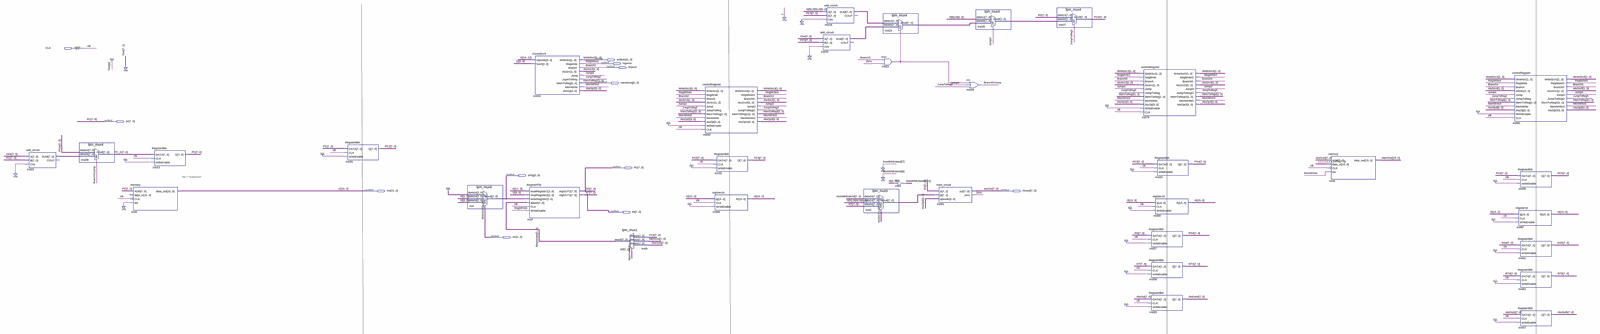
[diagram p0: schematic sheet, whole]
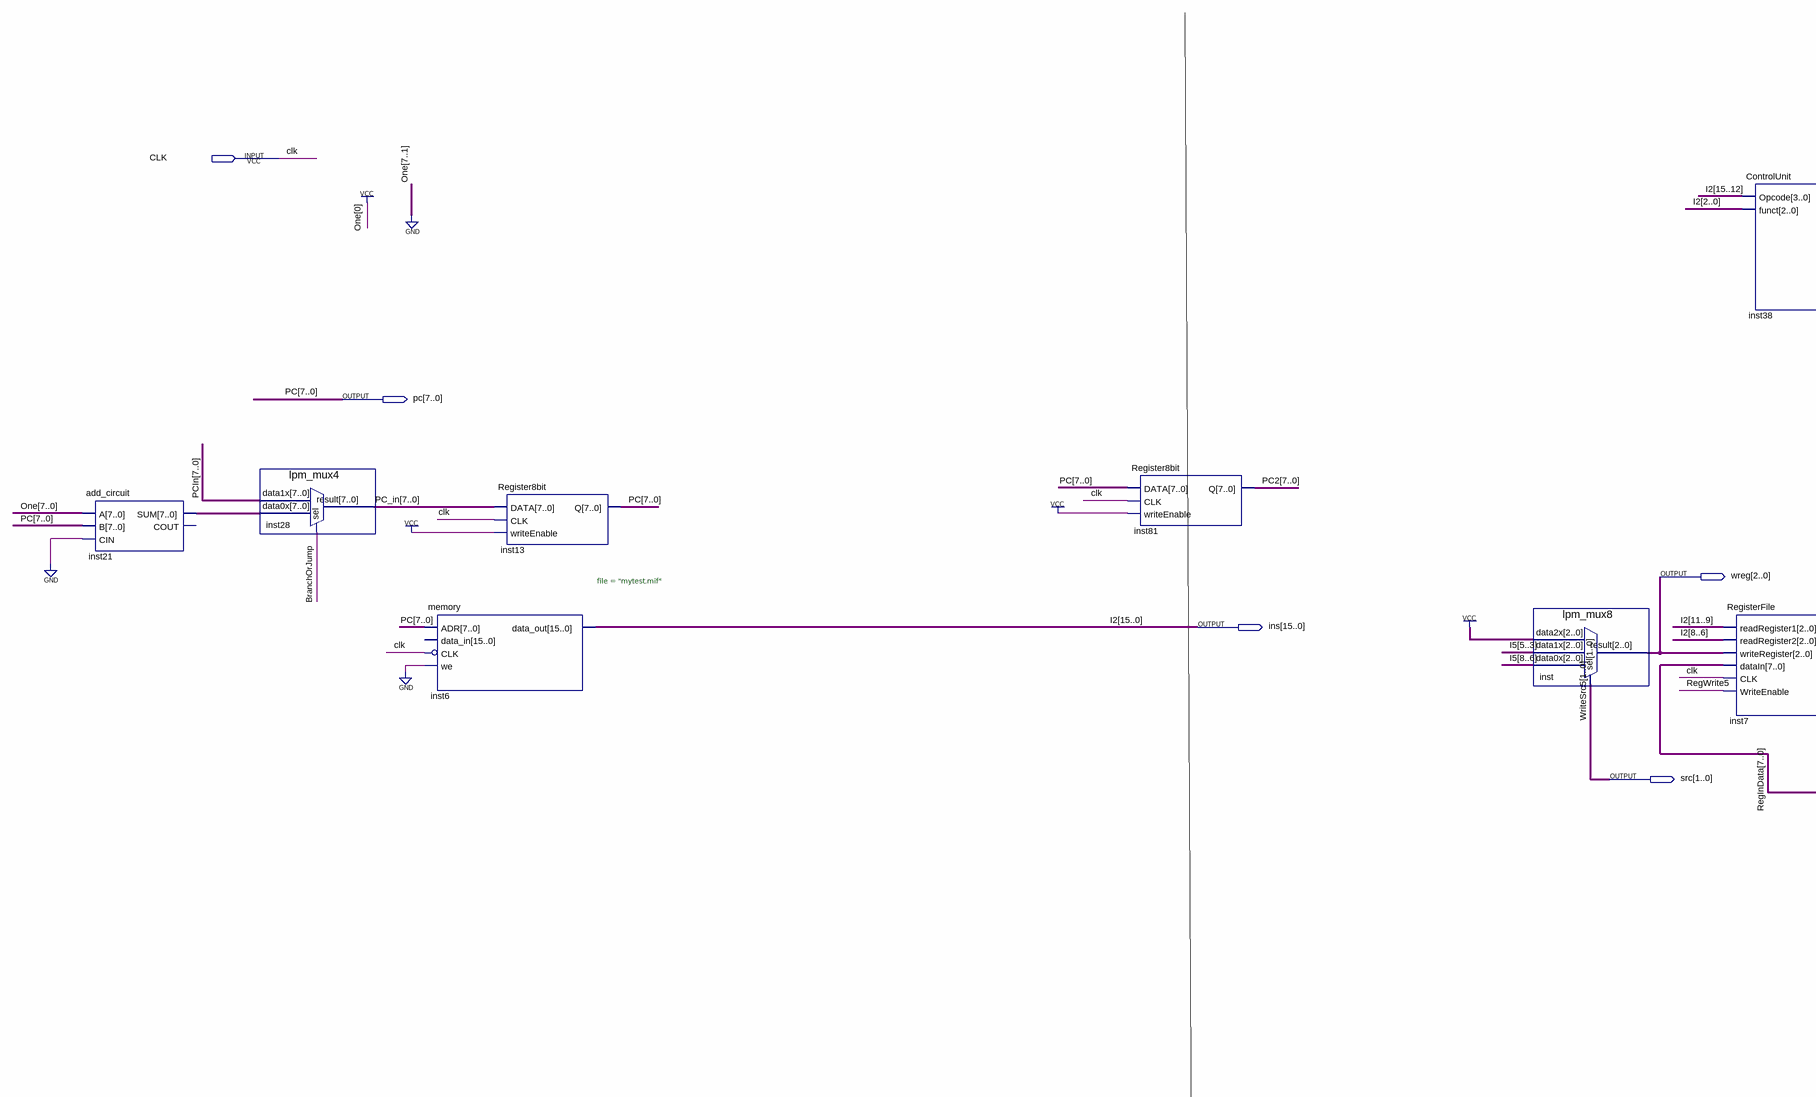
[diagram p1: schematic sheet, left part]
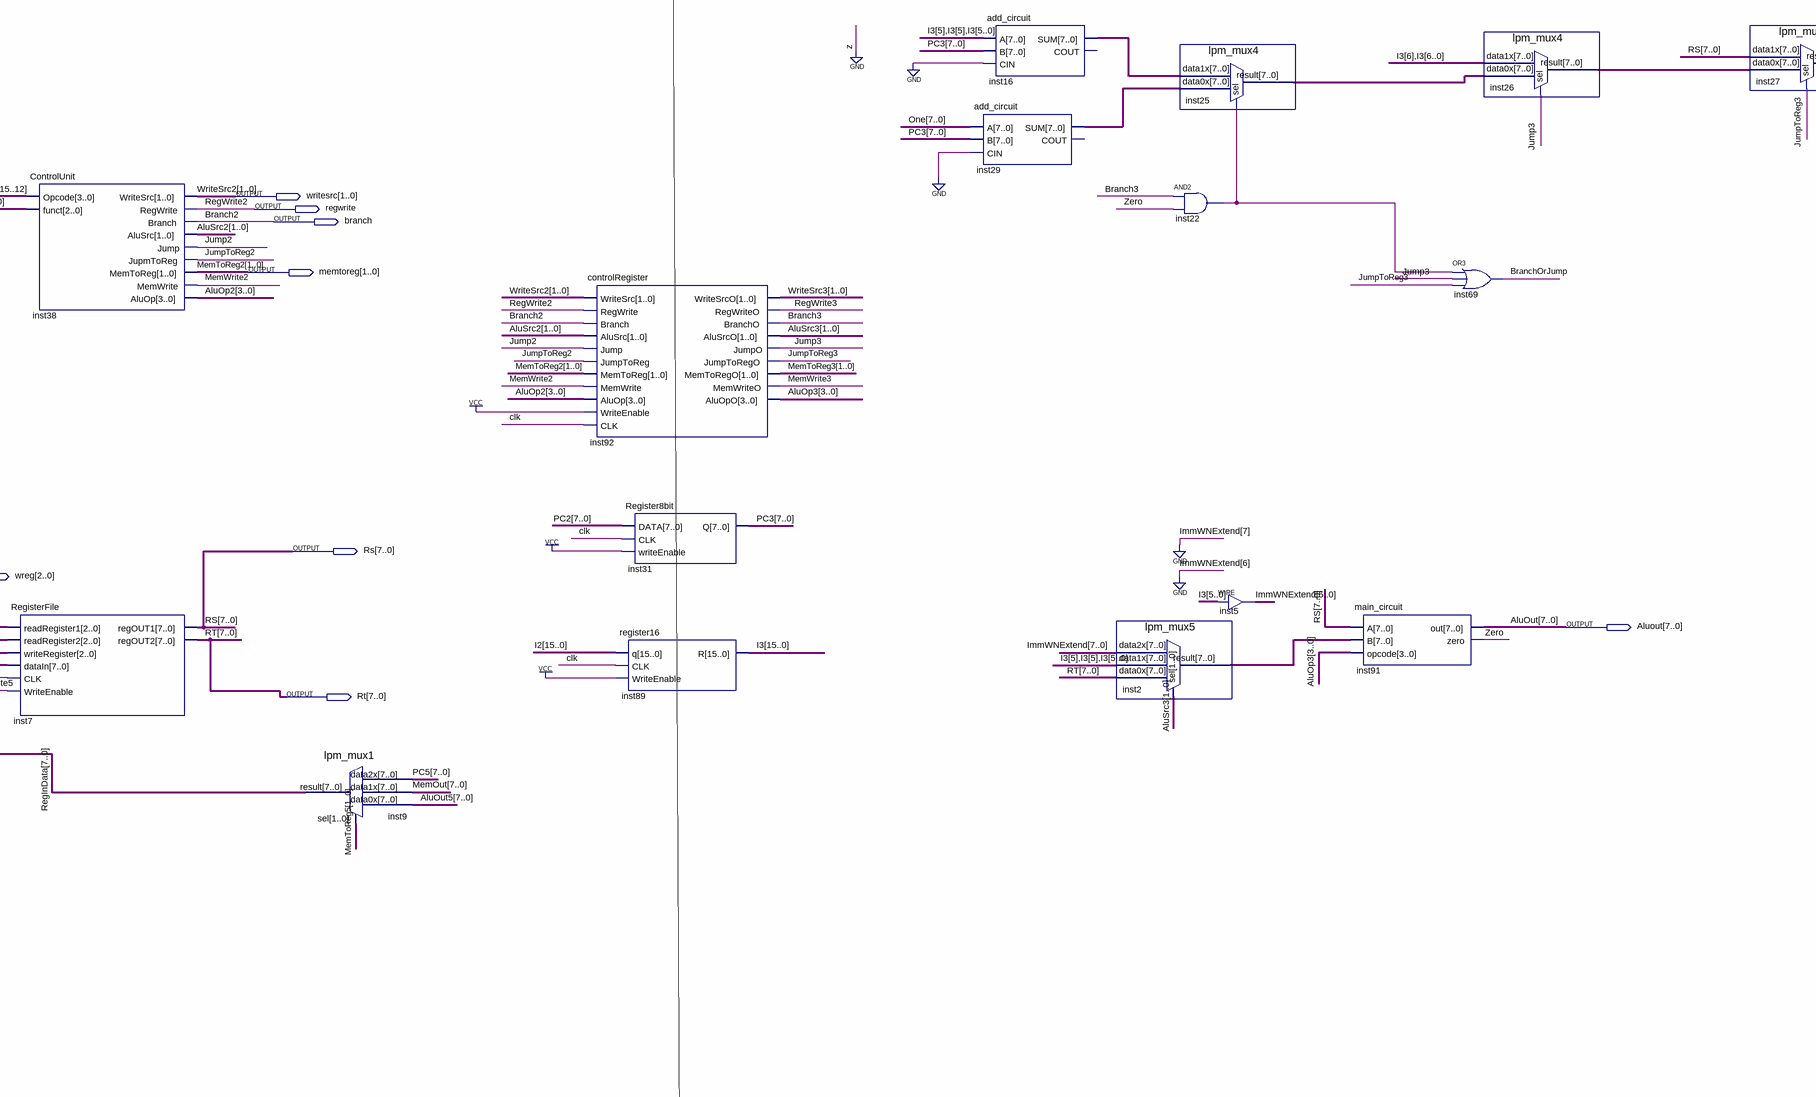
[diagram p2: schematic sheet, centre part]
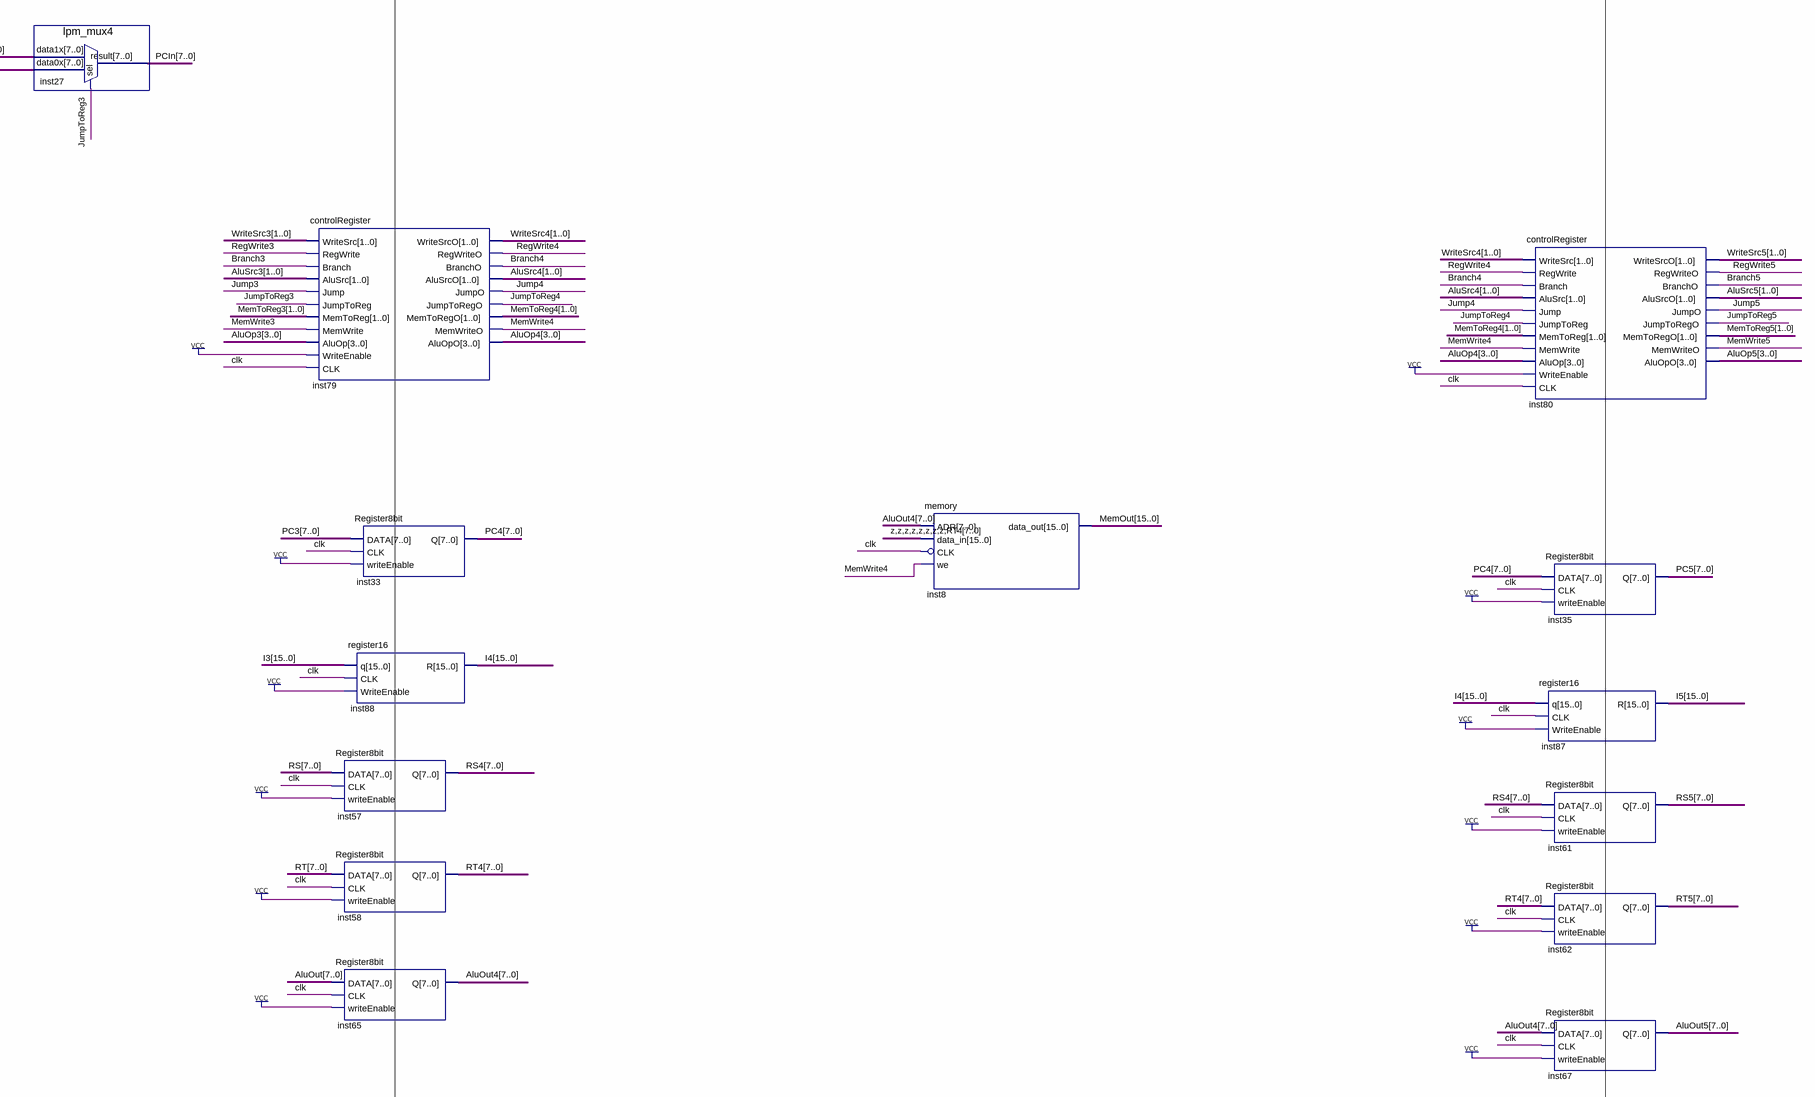
[diagram p3: schematic sheet, right part]
// Quartus schematic MipsDataPath.bdf as structural Verilog: 35 symbols, 12 pins
module MipsDataPath (
  input  CLK,
  output [1:0] writesrc,
  output regwrite,
  output branch,
  output [1:0] memtoreg,
  output [7:0] pc,
  output [7:0] Rs,
  output [2:0] wreg,
  output [15:0] ins,
  output [7:0] Aluout,
  output [7:0] Rt,
  output [1:0] src
);

  wire Branch3, Branch4, Branch5, BranchOrJump, inst22_out, Jump2, Jump3, Jump4, Jump5, JumpToReg2,
       JumpToReg3, JumpToReg4, JumpToReg5, MemWrite2, MemWrite3, MemWrite4, MemWrite5, RegWrite3, RegWrite4,
       RegWrite5, Zero;
  wire [1:0] AluSrc2, AluSrc3, AluSrc4, AluSrc5, MemToReg3, MemToReg4, MemToReg5, WriteSrc3, WriteSrc4;
  wire [3:0] AluOp2, AluOp3, AluOp4, AluOp5;
  wire [5:0] ImmWNExtend;
  wire [7:0] AluOut4, AluOut5, inst2_result, inst16_sum, inst21_sum, inst25_result, inst26_result,
       inst29_sum, PC2, PC3, PC4, PC5, PC_in, PCIn, RegInData, RS4, RS5, RT4, RT5;
  wire [15:0] I3, I4, I5, MemOut;

  add_circuit inst21 (.A(8'b00000001), .B(pc), .CIN(1'b0), .SUM(inst21_sum));  // open: COUT
  lpm_mux4 inst28 (.data1x(PCIn), .data0x(inst21_sum), .sel(BranchOrJump), .result(PC_in));
  memory #(.file("mytest.mif")) inst6 (.ADR(pc), .CLK(~CLK), .we(1'b0), .data_out(ins));  // open: data_in
  Register8bit inst13 (.DATA(PC_in), .CLK(CLK), .writeEnable(1'b1), .Q(pc));
  Register8bit inst81 (.DATA(pc), .CLK(CLK), .writeEnable(1'b1), .Q(PC2));
  lpm_mux8 inst (.data2x(3'b111), .data1x(I5[5:3]), .data0x(I5[8:6]), .sel(src), .result(wreg));
  RegisterFile inst7 (
    .CLK(CLK), .WriteEnable(RegWrite5), .dataIn(RegInData), .readRegister1(ins[11:9]),
    .readRegister2(ins[8:6]), .writeRegister(wreg), .regOUT1(Rs), .regOUT2(Rt));
  ControlUnit inst38 (
    .Opcode(ins[15:12]), .funct(ins[2:0]), .WriteSrc(writesrc), .RegWrite(regwrite), .Branch(branch),
    .AluSrc(AluSrc2), .Jump(Jump2), .JupmToReg(JumpToReg2), .MemToReg(memtoreg), .MemWrite(MemWrite2),
    .AluOp(AluOp2));
  lpm_mux1 inst9 (.data2x(PC5), .data1x(MemOut[7:0]), .data0x(AluOut5), .sel(MemToReg5), .result(RegInData));
  controlRegister inst92 (
    .WriteSrc(writesrc), .RegWrite(regwrite), .Branch(branch), .AluSrc(AluSrc2), .Jump(Jump2),
    .JumpToReg(JumpToReg2), .MemToReg(memtoreg), .MemWrite(MemWrite2), .AluOp(AluOp2), .WriteEnable(1'b1),
    .CLK(CLK), .WriteSrcO(WriteSrc3), .RegWriteO(RegWrite3), .BranchO(Branch3), .AluSrcO(AluSrc3),
    .JumpO(Jump3), .JumpToRegO(JumpToReg3), .MemToRegO(MemToReg3), .MemWriteO(MemWrite3), .AluOpO(AluOp3));
  register16 inst89 (.q(ins), .CLK(CLK), .WriteEnable(1'b1), .R(I3));
  Register8bit inst31 (.DATA(PC2), .CLK(CLK), .writeEnable(1'b1), .Q(PC3));
  add_circuit inst29 (.A(8'b00000001), .B(PC3), .CIN(1'b0), .SUM(inst29_sum));  // open: COUT
  add_circuit inst16 (.A({{3{I3[5]}}, I3[4:0]}), .B(PC3), .CIN(1'b0), .SUM(inst16_sum));  // open: COUT
  lpm_mux5 inst2 (
    .data2x({2'b00, ImmWNExtend}), .data1x({{3{I3[5]}}, I3[4:0]}), .data0x(Rt), .sel(AluSrc3),
    .result(inst2_result));
  and inst22 (inst22_out, Branch3, Zero);
  lpm_mux4 inst25 (.data1x(inst16_sum), .data0x(inst29_sum), .sel(inst22_out), .result(inst25_result));
  assign ImmWNExtend = I3[5:0];  // WIRE inst5
  main_circuit inst91 (.A(Rs), .B(inst2_result), .opcode(AluOp3), .out(Aluout), .zero(Zero));
  or inst69 (BranchOrJump, inst22_out, Jump3, JumpToReg3);
  lpm_mux4 inst26 (.data1x({{2{I3[6]}}, I3[5:0]}), .data0x(inst25_result), .sel(Jump3), .result(inst26_result));
  lpm_mux4 inst27 (.data1x(Rs), .data0x(inst26_result), .sel(JumpToReg3), .result(PCIn));
  controlRegister inst79 (
    .WriteSrc(WriteSrc3), .RegWrite(RegWrite3), .Branch(Branch3), .AluSrc(AluSrc3), .Jump(Jump3),
    .JumpToReg(JumpToReg3), .MemToReg(MemToReg3), .MemWrite(MemWrite3), .AluOp(AluOp3), .WriteEnable(1'b1),
    .CLK(CLK), .WriteSrcO(WriteSrc4), .RegWriteO(RegWrite4), .BranchO(Branch4), .AluSrcO(AluSrc4),
    .JumpO(Jump4), .JumpToRegO(JumpToReg4), .MemToRegO(MemToReg4), .MemWriteO(MemWrite4), .AluOpO(AluOp4));
  Register8bit inst33 (.DATA(PC3), .CLK(CLK), .writeEnable(1'b1), .Q(PC4));
  register16 inst88 (.q(I3), .CLK(CLK), .WriteEnable(1'b1), .R(I4));
  Register8bit inst57 (.DATA(Rs), .CLK(CLK), .writeEnable(1'b1), .Q(RS4));
  Register8bit inst58 (.DATA(Rt), .CLK(CLK), .writeEnable(1'b1), .Q(RT4));
  Register8bit inst65 (.DATA(Aluout), .CLK(CLK), .writeEnable(1'b1), .Q(AluOut4));
  memory inst8 (.ADR(AluOut4), .CLK(~CLK), .data_in({{8{1'b0}}, RT4}), .we(MemWrite4), .data_out(MemOut));
  controlRegister inst80 (
    .WriteSrc(WriteSrc4), .RegWrite(RegWrite4), .Branch(Branch4), .AluSrc(AluSrc4), .Jump(Jump4),
    .JumpToReg(JumpToReg4), .MemToReg(MemToReg4), .MemWrite(MemWrite4), .AluOp(AluOp4), .WriteEnable(1'b1),
    .CLK(CLK), .WriteSrcO(src), .RegWriteO(RegWrite5), .BranchO(Branch5), .AluSrcO(AluSrc5), .JumpO(Jump5),
    .JumpToRegO(JumpToReg5), .MemToRegO(MemToReg5), .MemWriteO(MemWrite5), .AluOpO(AluOp5));
  register16 inst87 (.q(I4), .CLK(CLK), .WriteEnable(1'b1), .R(I5));
  Register8bit inst35 (.DATA(PC4), .CLK(CLK), .writeEnable(1'b1), .Q(PC5));
  Register8bit inst61 (.DATA(RS4), .CLK(CLK), .writeEnable(1'b1), .Q(RS5));
  Register8bit inst62 (.DATA(RT4), .CLK(CLK), .writeEnable(1'b1), .Q(RT5));
  Register8bit inst67 (.DATA(AluOut4), .CLK(CLK), .writeEnable(1'b1), .Q(AluOut5));

  // Other names for the same wires on the sheet: Branch2 = branch; I2[15:0] = ins; MemToReg2[1:0] = memtoreg;
  //   RegWrite2 = regwrite; WriteSrc2[1:0] = writesrc; WriteSrc5[1:0] = src
endmodule
